# Altium project PCB_Project_do_an_1.PrjPcb
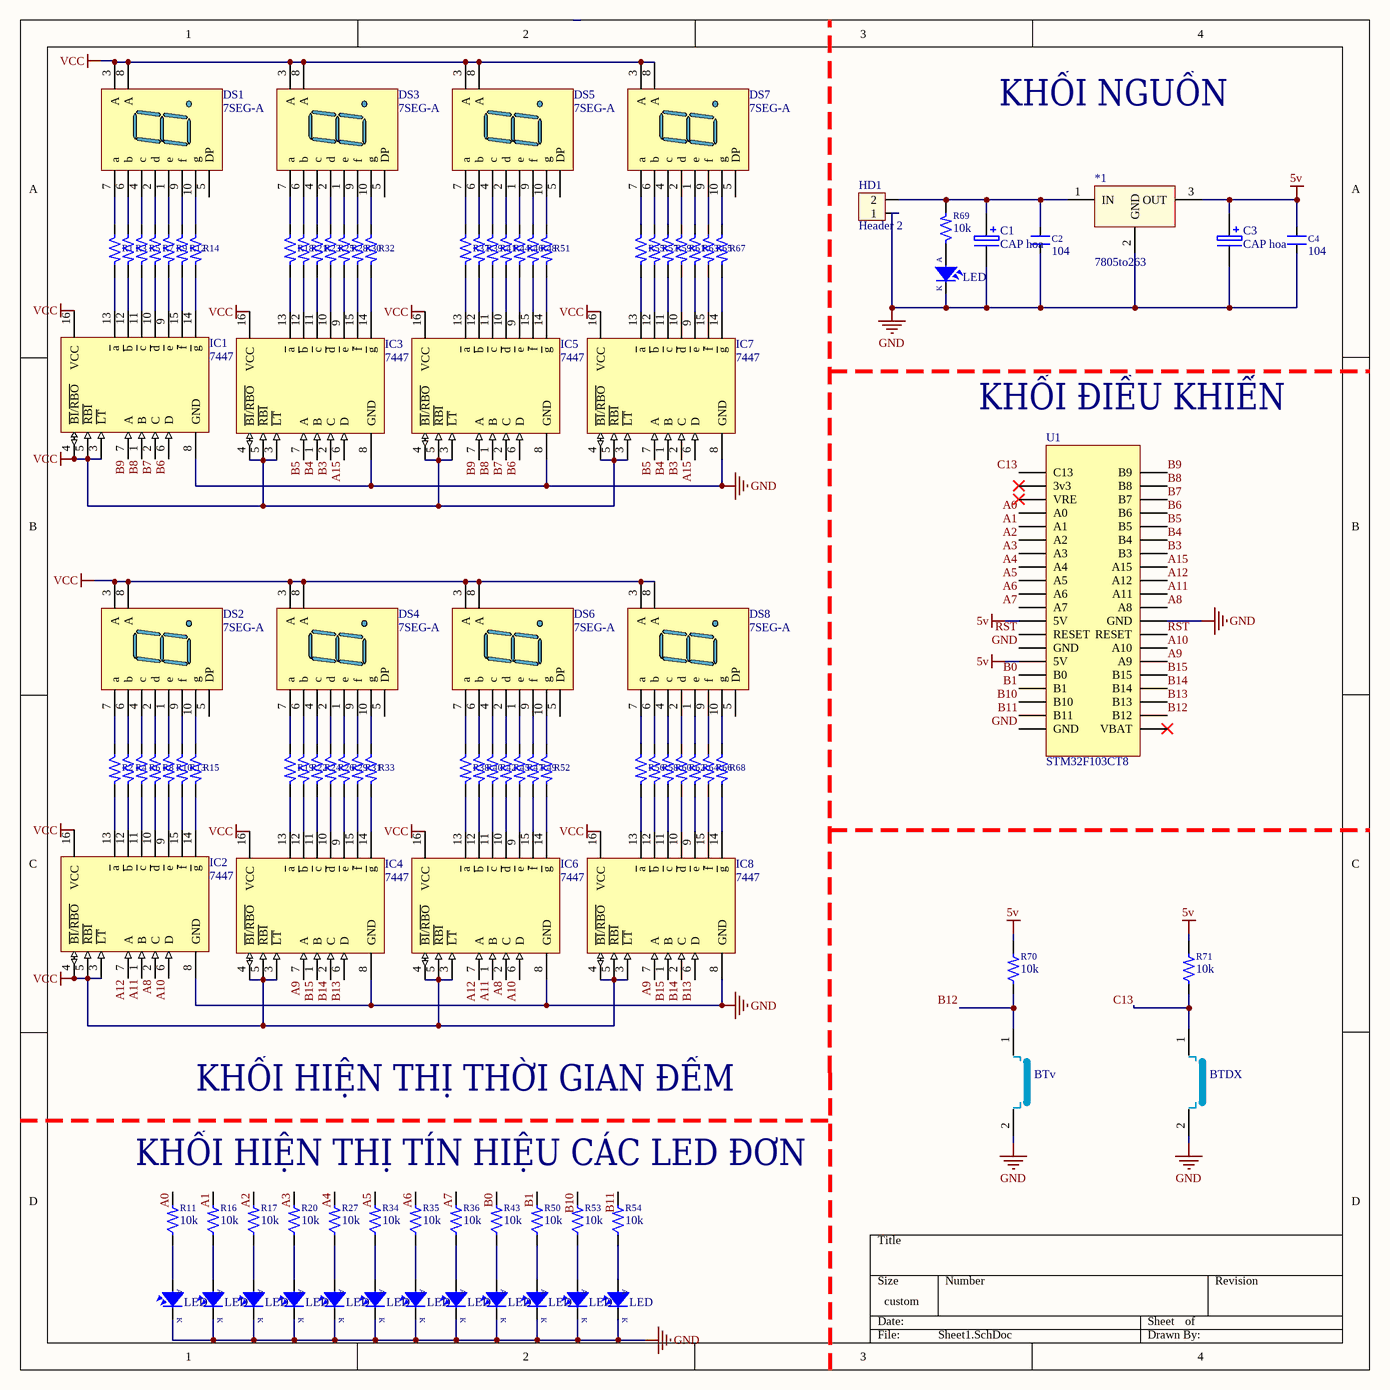
[diagram p0: Sheet1.SchDoc]
1 sheet, 109 parts. Net scope: global (net labels, ports and power ports of the same name join across sheets).
Board file: PCB1.PcbDoc

## Sheet Sheet1.SchDoc
size 254 x 254 mm

### Parts
*1  7805to263  [7805]
BT1  BTv  [SW4]
BT2  BTDX  [SW4]
C1  CAP hoa  [CP1/2]
C2  104  [SM-CAP-0805]
C3  CAP hoa  [CP1/2]
C4  104  [SM-CAP-0805]
DS1  7SEG-A  [LED7SEG]
DS2  7SEG-A  [LED7SEG]
DS3  7SEG-A  [LED7SEG]
DS4  7SEG-A  [LED7SEG]
DS5  7SEG-A  [LED7SEG]
DS6  7SEG-A  [LED7SEG]
DS7  7SEG-A  [LED7SEG]
DS8  7SEG-A  [LED7SEG]
HD1  Header 2  [HED2]
IC1  7447  [ic74ls47]
IC2  7447  [ic74ls47]
IC3  7447  [ic74ls47]
IC4  7447  [ic74ls47]
IC5  7447  [ic74ls47]
IC6  7447  [ic74ls47]
IC7  7447  [ic74ls47]
IC8  7447  [ic74ls47]
LED1  LED  [LED-3]
LED2  LED  [LED-3]
LED3  LED  [LED-3]
LED4  LED  [LED-3]
LED5  LED  [LED-3]
LED6  LED  [LED-3]
LED7  LED  [LED-3]
LED8  LED  [LED-3]
LED9  LED  [LED-3]
LED10  LED  [LED-3]
LED11  LED  [LED-3]
LED12  LED  [LED-3]
LED13  LED  [LED-3]
R1  10k  [Resistor SMD0603]  (value not drawn)
R2  10k  [Resistor SMD0603]  (value not drawn)
R3  10k  [Resistor SMD0603]  (value not drawn)
R4  10k  [Resistor SMD0603]  (value not drawn)
R5  10k  [Resistor SMD0603]  (value not drawn)
R6  10k  [Resistor SMD0603]  (value not drawn)
R7  10k  [Resistor SMD0603]  (value not drawn)
R8  10k  [Resistor SMD0603]  (value not drawn)
R9  10k  [Resistor SMD0603]  (value not drawn)
R10  10k  [Resistor SMD0603]  (value not drawn)
R11  10k  [Resistor SMD0603]
R12  10k  [Resistor SMD0603]  (value not drawn)
R13  10k  [Resistor SMD0603]  (value not drawn)
R14  10k  [Resistor SMD0603]  (value not drawn)
R15  10k  [Resistor SMD0603]  (value not drawn)
R16  10k  [Resistor SMD0603]
R17  10k  [Resistor SMD0603]
R18  10k  [Resistor SMD0603]  (value not drawn)
R19  10k  [Resistor SMD0603]  (value not drawn)
R20  10k  [Resistor SMD0603]
R21  10k  [Resistor SMD0603]  (value not drawn)
R22  10k  [Resistor SMD0603]  (value not drawn)
R23  10k  [Resistor SMD0603]  (value not drawn)
R24  10k  [Resistor SMD0603]  (value not drawn)
R25  10k  [Resistor SMD0603]  (value not drawn)
R26  10k  [Resistor SMD0603]  (value not drawn)
R27  10k  [Resistor SMD0603]
R28  10k  [Resistor SMD0603]  (value not drawn)
R29  10k  [Resistor SMD0603]  (value not drawn)
R30  10k  [Resistor SMD0603]  (value not drawn)
R31  10k  [Resistor SMD0603]  (value not drawn)
R32  10k  [Resistor SMD0603]  (value not drawn)
R33  10k  [Resistor SMD0603]  (value not drawn)
R34  10k  [Resistor SMD0603]
R35  10k  [Resistor SMD0603]
R36  10k  [Resistor SMD0603]
R37  10k  [Resistor SMD0603]  (value not drawn)
R38  10k  [Resistor SMD0603]  (value not drawn)
R39  10k  [Resistor SMD0603]  (value not drawn)
R40  10k  [Resistor SMD0603]  (value not drawn)
R41  10k  [Resistor SMD0603]  (value not drawn)
R42  10k  [Resistor SMD0603]  (value not drawn)
R43  10k  [Resistor SMD0603]
R44  10k  [Resistor SMD0603]  (value not drawn)
R45  10k  [Resistor SMD0603]  (value not drawn)
R46  10k  [Resistor SMD0603]  (value not drawn)
R47  10k  [Resistor SMD0603]  (value not drawn)
R48  10k  [Resistor SMD0603]  (value not drawn)
R49  10k  [Resistor SMD0603]  (value not drawn)
R50  10k  [Resistor SMD0603]
R51  10k  [Resistor SMD0603]  (value not drawn)
R52  10k  [Resistor SMD0603]  (value not drawn)
R53  10k  [Resistor SMD0603]
R54  10k  [Resistor SMD0603]
R55  10k  [Resistor SMD0603]  (value not drawn)
R56  10k  [Resistor SMD0603]  (value not drawn)
R57  10k  [Resistor SMD0603]  (value not drawn)
R58  10k  [Resistor SMD0603]  (value not drawn)
R59  10k  [Resistor SMD0603]  (value not drawn)
R60  10k  [Resistor SMD0603]  (value not drawn)
R61  10k  [Resistor SMD0603]  (value not drawn)
R62  10k  [Resistor SMD0603]  (value not drawn)
R63  10k  [Resistor SMD0603]  (value not drawn)
R64  10k  [Resistor SMD0603]  (value not drawn)
R65  10k  [Resistor SMD0603]  (value not drawn)
R66  10k  [Resistor SMD0603]  (value not drawn)
R67  10k  [Resistor SMD0603]  (value not drawn)
R68  10k  [Resistor SMD0603]  (value not drawn)
R69  10k  [Resistor SMD0603]
R70  10k  [Resistor SMD0603]
R71  10k  [Resistor SMD0603]
U1  STM32F103CT8  [STM32F103CT6]

### Nets
5v: *1.3(OUT) C3.1 C4.2 R70.2 R71.2 U1.12(5V) U1.15(5V)
GND: *1.2(GND) BT1.2 BT2.2 C1.2 C2.1 C3.2 C4.1 HD1.1 IC1.8(GND) IC2.8(GND) IC3.8(GND) IC4.8(GND) IC5.8(GND) IC6.8(GND) IC7.8(GND) IC8.8(GND) LED1.2(K) LED2.2(K) LED3.2(K) LED4.2(K) LED5.2(K) LED6.2(K) LED7.2(K) LED8.2(K) LED9.2(K) LED10.2(K) LED11.2(K) LED12.2(K) LED13.2(K) U1.14(GND) U1.20(GND) U1.32(GND)
VCC: DS1.3(A) DS1.8(A) DS2.3(A) DS2.8(A) DS3.3(A) DS3.8(A) DS4.3(A) DS4.8(A) DS5.3(A) DS5.8(A) DS6.3(A) DS6.8(A) DS7.3(A) DS7.8(A) DS8.3(A) DS8.8(A) IC1.3(~{LT}) IC1.4(~{BI}/~{RBO}) IC1.5(~{RBI}) IC1.16(VCC) IC2.3(~{LT}) IC2.4(~{BI}/~{RBO}) IC2.5(~{RBI}) IC2.16(VCC) IC3.3(~{LT}) IC3.4(~{BI}/~{RBO}) IC3.5(~{RBI}) IC3.16(VCC) IC4.3(~{LT}) IC4.4(~{BI}/~{RBO}) IC4.5(~{RBI}) IC4.16(VCC) IC5.3(~{LT}) IC5.4(~{BI}/~{RBO}) IC5.5(~{RBI}) IC5.16(VCC) IC6.3(~{LT}) IC6.4(~{BI}/~{RBO}) IC6.5(~{RBI}) IC6.16(VCC) IC7.3(~{LT}) IC7.4(~{BI}/~{RBO}) IC7.5(~{RBI}) IC7.16(VCC) IC8.3(~{LT}) IC8.4(~{BI}/~{RBO}) IC8.5(~{RBI}) IC8.16(VCC)
A0: R11.2 U1.4(A0)
A1: R16.2 U1.5(A1)
A2: R17.2 U1.6(A2)
A3: R20.2 U1.7(A3)
A4: R27.2 U1.8(A4)
A5: R34.2 U1.9(A5)
A6: R35.2 U1.10(A6)
A7: R36.2 U1.11(A7)
A8: IC2.2(C) IC6.2(C) U1.31(A8)
A9: IC4.7(A) IC8.7(A) U1.35(A9)
A10: IC2.6(D) IC6.6(D) U1.34(A10)
A11: IC2.1(B) IC6.1(B) U1.30(A11)
A12: IC2.7(A) IC6.7(A) U1.29(A12)
A15: IC3.6(D) IC7.6(D) U1.28(A15)
B0: R43.2 U1.16(B0)
B1: R50.2 U1.17(B1)
B3: IC3.2(C) IC7.2(C) U1.27(B3)
B4: IC3.1(B) IC7.1(B) U1.26(B4)
B5: IC3.7(A) IC7.7(A) U1.25(B5)
B6: IC1.6(D) IC5.6(D) U1.24(B6)
B7: IC1.2(C) IC5.2(C) U1.23(B7)
B8: IC1.1(B) IC5.1(B) U1.22(B8)
B9: IC1.7(A) IC5.7(A) U1.21(B9)
B10: R53.2 U1.18(B10)
B11: R54.2 U1.19(B11)
B12: BT1.1 R70.1 U1.39(B12)
B13: IC4.6(D) IC8.6(D) U1.38(B13)
B14: IC4.2(C) IC8.2(C) U1.37(B14)
B15: IC4.1(B) IC8.1(B) U1.36(B15)
C13: BT2.1 R71.1 U1.1(C13)
RST: U1.13(RESET) U1.33(RESET)
Net*1_1: *1.1(IN) C1.1 C2.2 HD1.2 R69.2
NetDS1_1: DS1.1(e) R9.1
NetDS1_2: DS1.2(d) R7.1
NetDS1_4: DS1.4(c) R5.1
NetDS1_6: DS1.6(b) R3.1
NetDS1_7: DS1.7(a) R1.1
NetDS1_9: DS1.9(f) R12.1
NetDS1_10: DS1.10(g) R14.1
NetDS2_1: DS2.1(e) R10.1
NetDS2_2: DS2.2(d) R8.1
NetDS2_4: DS2.4(c) R6.1
NetDS2_6: DS2.6(b) R4.1
NetDS2_7: DS2.7(a) R2.1
NetDS2_9: DS2.9(f) R13.1
NetDS2_10: DS2.10(g) R15.1
NetDS3_1: DS3.1(e) R28.1
NetDS3_2: DS3.2(d) R25.1
NetDS3_4: DS3.4(c) R23.1
NetDS3_6: DS3.6(b) R21.1
NetDS3_7: DS3.7(a) R18.1
NetDS3_9: DS3.9(f) R30.1
NetDS3_10: DS3.10(g) R32.1
NetDS4_1: DS4.1(e) R29.1
NetDS4_2: DS4.2(d) R26.1
NetDS4_4: DS4.4(c) R24.1
NetDS4_6: DS4.6(b) R22.1
NetDS4_7: DS4.7(a) R19.1
NetDS4_9: DS4.9(f) R31.1
NetDS4_10: DS4.10(g) R33.1
NetDS5_1: DS5.1(e) R46.1
NetDS5_2: DS5.2(d) R44.1
NetDS5_4: DS5.4(c) R41.1
NetDS5_6: DS5.6(b) R39.1
NetDS5_7: DS5.7(a) R37.1
NetDS5_9: DS5.9(f) R48.1
NetDS5_10: DS5.10(g) R51.1
NetDS6_1: DS6.1(e) R47.1
NetDS6_2: DS6.2(d) R45.1
NetDS6_4: DS6.4(c) R42.1
NetDS6_6: DS6.6(b) R40.1
NetDS6_7: DS6.7(a) R38.1
NetDS6_9: DS6.9(f) R49.1
NetDS6_10: DS6.10(g) R52.1
NetDS7_1: DS7.1(e) R63.1
NetDS7_2: DS7.2(d) R61.1
NetDS7_4: DS7.4(c) R59.1
NetDS7_6: DS7.6(b) R57.1
NetDS7_7: DS7.7(a) R55.1
NetDS7_9: DS7.9(f) R65.1
NetDS7_10: DS7.10(g) R67.1
NetDS8_1: DS8.1(e) R64.1
NetDS8_2: DS8.2(d) R62.1
NetDS8_4: DS8.4(c) R60.1
NetDS8_6: DS8.6(b) R58.1
NetDS8_7: DS8.7(a) R56.1
NetDS8_9: DS8.9(f) R66.1
NetDS8_10: DS8.10(g) R68.1
NetIC1_9: IC1.9(~{e}) R9.2
NetIC1_10: IC1.10(~{d}) R7.2
NetIC1_11: IC1.11(~{c}) R5.2
NetIC1_12: IC1.12(~{b}) R3.2
NetIC1_13: IC1.13(~{a}) R1.2
NetIC1_14: IC1.14(~{g}) R14.2
NetIC1_15: IC1.15(~{f}) R12.2
NetIC2_9: IC2.9(~{e}) R10.2
NetIC2_10: IC2.10(~{d}) R8.2
NetIC2_11: IC2.11(~{c}) R6.2
NetIC2_12: IC2.12(~{b}) R4.2
NetIC2_13: IC2.13(~{a}) R2.2
NetIC2_14: IC2.14(~{g}) R15.2
NetIC2_15: IC2.15(~{f}) R13.2
NetIC3_9: IC3.9(~{e}) R28.2
NetIC3_10: IC3.10(~{d}) R25.2
NetIC3_11: IC3.11(~{c}) R23.2
NetIC3_12: IC3.12(~{b}) R21.2
NetIC3_13: IC3.13(~{a}) R18.2
NetIC3_14: IC3.14(~{g}) R32.2
NetIC3_15: IC3.15(~{f}) R30.2
NetIC4_9: IC4.9(~{e}) R29.2
NetIC4_10: IC4.10(~{d}) R26.2
NetIC4_11: IC4.11(~{c}) R24.2
NetIC4_12: IC4.12(~{b}) R22.2
NetIC4_13: IC4.13(~{a}) R19.2
NetIC4_14: IC4.14(~{g}) R33.2
NetIC4_15: IC4.15(~{f}) R31.2
NetIC5_9: IC5.9(~{e}) R46.2
NetIC5_10: IC5.10(~{d}) R44.2
NetIC5_11: IC5.11(~{c}) R41.2
NetIC5_12: IC5.12(~{b}) R39.2
NetIC5_13: IC5.13(~{a}) R37.2
NetIC5_14: IC5.14(~{g}) R51.2
NetIC5_15: IC5.15(~{f}) R48.2
NetIC6_9: IC6.9(~{e}) R47.2
NetIC6_10: IC6.10(~{d}) R45.2
NetIC6_11: IC6.11(~{c}) R42.2
NetIC6_12: IC6.12(~{b}) R40.2
NetIC6_13: IC6.13(~{a}) R38.2
NetIC6_14: IC6.14(~{g}) R52.2
NetIC6_15: IC6.15(~{f}) R49.2
NetIC7_9: IC7.9(~{e}) R63.2
NetIC7_10: IC7.10(~{d}) R61.2
NetIC7_11: IC7.11(~{c}) R59.2
NetIC7_12: IC7.12(~{b}) R57.2
NetIC7_13: IC7.13(~{a}) R55.2
NetIC7_14: IC7.14(~{g}) R67.2
NetIC7_15: IC7.15(~{f}) R65.2
NetIC8_9: IC8.9(~{e}) R64.2
NetIC8_10: IC8.10(~{d}) R62.2
NetIC8_11: IC8.11(~{c}) R60.2
NetIC8_12: IC8.12(~{b}) R58.2
NetIC8_13: IC8.13(~{a}) R56.2
NetIC8_14: IC8.14(~{g}) R68.2
NetIC8_15: IC8.15(~{f}) R66.2
NetLED1_1: LED1.1(A) R11.1
NetLED2_1: LED2.1(A) R16.1
NetLED3_1: LED3.1(A) R17.1
NetLED4_1: LED4.1(A) R20.1
NetLED5_1: LED5.1(A) R27.1
NetLED6_1: LED6.1(A) R34.1
NetLED7_1: LED7.1(A) R35.1
NetLED8_1: LED8.1(A) R36.1
NetLED9_1: LED9.1(A) R43.1
NetLED10_1: LED10.1(A) R50.1
NetLED11_1: LED11.1(A) R53.1
NetLED12_1: LED12.1(A) R54.1
NetLED13_1: LED13.1(A) R69.1

Not connected (* = marked no-connect by the designer): DS1 5(DP); DS2 5(DP); DS3 5(DP); DS4 5(DP); DS5 5(DP); DS6 5(DP); DS7 5(DP); DS8 5(DP); U1 2(3v3)* 3(VRE)* 40(VBAT)*

### Notes on the sheet
- KHỐI NGUỒN
- KHỐI ĐIỀU KHIỂN
- KHỐI HIỆN THỊ THỜI GIAN ĐẾM
- KHỐI HIỆN THỊ TÍN HIỆU CÁC LED ĐƠN

### Library data of the parts
BT1 BT2 = BUTTON
C1 C3 = CAP hoa: Cap
C2 C4 = CAP SMD: Value: 0,1uF/300V; Designed by: VanDungEvn
DS1-DS8 = LED 7SEG-A: 14.2 mm General Purpose Blue 7-Segment Display: CA, RH DP, Gray Surface; MinimumIntensity: 2020 ucd; Note: IF = 10 mA; Published: 8-Jun-2000; LatestRevisionDate: 17-Dec-2003; LatestRevisionNote: Schematic revised, PCB Footprint replaced.; DatasheetDocument: 24-Sep-2002; PackageDocument: 24-Sep-2002; PackageReference: H; Publisher: Altium Limited; Colour: Blue; ComponentLink1Description: Manufacturer Link; ComponentLink1URL: http://www.agilent.com/
HD1 = Header 2: Header 2 (Green); Value: Header 2
IC1-IC8 = 7447: BCD to 7-Segment Decoder/Driver; Value: 7447 , 74247
LED1-LED13 = LED: LED Single colour Green and Red; Value: LED 3 ly Single Colour
R1-R71 = Res SMD: Res